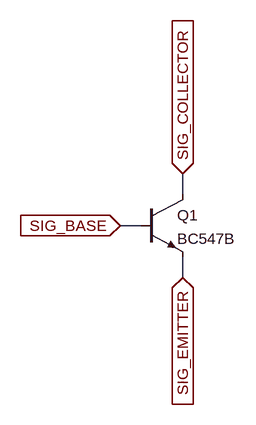
[diagram p0: schematic singleTransistor.asc]
singleTransistor.asc, the LTspice schematic file:
Version 4
SHEET 1 880 680
WIRE 160 144 160 112
WIRE 96 192 64 192
WIRE 160 272 160 240
FLAG 64 192 SIG_BASE
IOPIN 64 192 In
FLAG 160 112 SIG_COLLECTOR
IOPIN 160 112 In
FLAG 160 272 SIG_EMITTER
IOPIN 160 272 In
SYMBOL npn 96 144 R0
SYMATTR InstName Q1
SYMATTR Value BC547B

The netlist it stands for:
* singleTransistor.asc
Q1 SIG_COLLECTOR SIG_BASE SIG_EMITTER 0 BC547B
.model NPN NPN
.model PNP PNP
.lib standard.bjt
.backanno
.end